# Altium schematic sheet LC BigOne - TLC5940 driver.SchDoc: DBL TLC5940 driver for High load
size A4; Revision: 0; SheetNumber: 1; SheetTotal: 2; Version: 1.0; Variant: Variant; Modification: Mod; Project: Light Control; PageSetup: Record=PageOptions|CenterHorizontal=True|CenterVertical=True|PrintScale=0.97|XCorrection=1.00|YCorrection=1.00|PrintKind=1|BorderSize=5000000|LeftOffset=0|BottomOffset=0|Orientation=2|PaperLength=2970|PaperWidth=2100|Scale=100|PaperSource=7|PrintQuality=-4|MediaType=1|DitherType=10|PaperKind=A4|PrintScaleMode=1
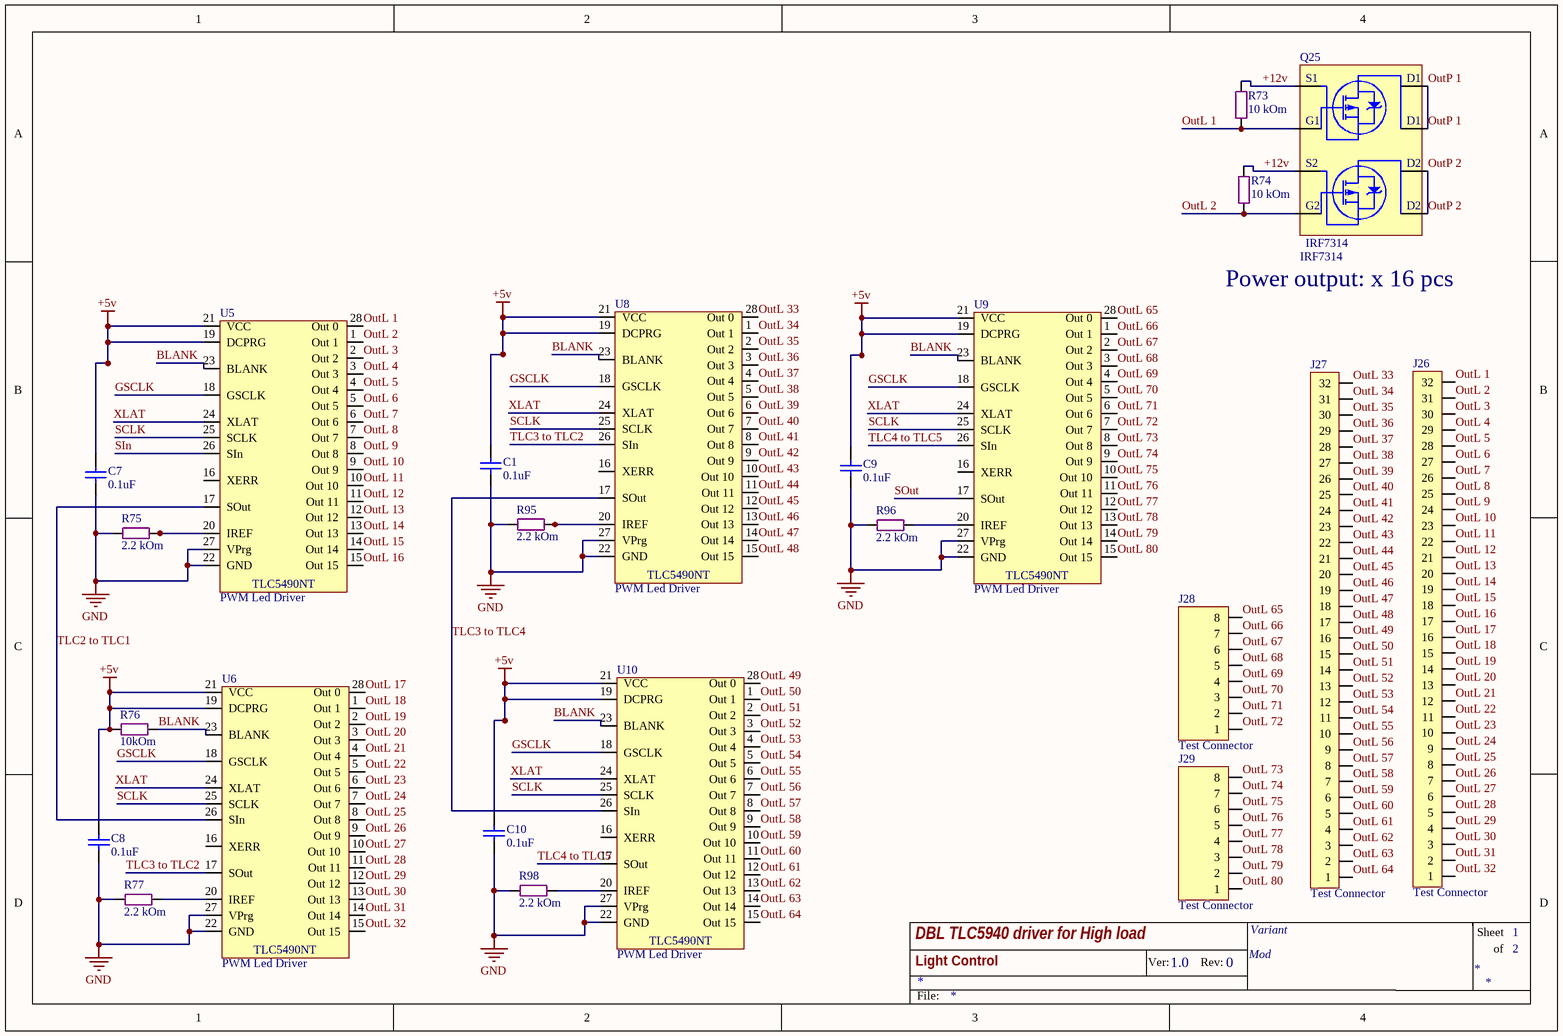
[diagram p0: LC BigOne - TLC5940 driver.SchDoc]

## Parts
C1  0.1uF  [SMD 0805 (2012)]
C7  0.1uF  [SMD 0805 (2012)]
C8  0.1uF  [SMD 0805 (2012)]
C9  0.1uF  [SMD 0805 (2012)]
C10  0.1uF  [SMD 0805 (2012)]
J26  Test Connector  [LINE 2.54 x 32]
J27  Test Connector  [LINE 2.54 x 32]
J28  Test Connector  [Line 2.54 x 8]
J29  Test Connector  [Line 2.54 x 8]
Q25  IRF7314  [SO8]
R73  10 kOm  [SMD 0805 (2012)]
R74  10 kOm  [SMD 0805 (2012)]
R75  2.2 kOm  [SMD 0805 (2012)]
R76  10kOm  [SMD 0805 (2012)]
R77  2.2 kOm  [SMD 0805 (2012)]
R95  2.2 kOm  [SMD 0805 (2012)]
R96  2.2 kOm  [SMD 0805 (2012)]
R98  2.2 kOm  [SMD 0805 (2012)]
U5  PWM Led Driver  [DIP-28 (OVAL)]
U6  PWM Led Driver  [DIP-28 (OVAL)]
U8  PWM Led Driver  [DIP-28 (OVAL)]
U9  PWM Led Driver  [DIP-28 (OVAL)]
U10  PWM Led Driver  [DIP-28 (OVAL)]

## Nets
+5v: C1.1 C7.1 C8.1 C9.1 C10.1 R76.1 U5.19(DCPRG) U5.21(VCC) U6.19(DCPRG) U6.21(VCC) U8.19(DCPRG) U8.21(VCC) U9.19(DCPRG) U9.21(VCC) U10.19(DCPRG) U10.21(VCC)
GND: C1.2 C7.2 C8.2 C9.2 C10.2 R75.2 R77.2 R95.2 R96.2 R98.2 U5.22(GND) U5.27(VPrg) U6.22(GND) U6.27(VPrg) U8.22(GND) U8.27(VPrg) U9.22(GND) U9.27(VPrg) U10.22(GND) U10.27(VPrg)
+12v: Q25.1(S) Q25.3(S) R73.2 R74.2
BLANK: R76.2 U5.23(BLANK) U6.23(BLANK) U8.23(BLANK) U9.23(BLANK) U10.23(BLANK)
GSCLK: U5.18(GSCLK) U6.18(GSCLK) U8.18(GSCLK) U9.18(GSCLK) U10.18(GSCLK)
OutL 1: J26.32 Q25.2(G) R73.1 U5.28(Out_0)
OutL 2: J26.31 Q25.4(G) R74.1 U5.1(Out_1)
OutL 3: J26.30 U5.2(Out_2)
OutL 4: J26.29 U5.3(Out_3)
OutL 5: J26.28 U5.4(Out_4)
OutL 6: J26.27 U5.5(Out_5)
OutL 7: J26.26 U5.6(Out_6)
OutL 8: J26.25 U5.7(Out_7)
OutL 9: J26.24 U5.8(Out_8)
OutL 10: J26.23 U5.9(Out_9)
OutL 11: J26.22 U5.10(Out_10)
OutL 12: J26.21 U5.11(Out_11)
OutL 13: J26.20 U5.12(Out_12)
OutL 14: J26.19 U5.13(Out_13)
OutL 15: J26.18 U5.14(Out_14)
OutL 16: J26.17 U5.15(Out_15)
OutL 17: J26.16 U6.28(Out_0)
OutL 18: J26.15 U6.1(Out_1)
OutL 19: J26.14 U6.2(Out_2)
OutL 20: J26.13 U6.3(Out_3)
OutL 21: J26.12 U6.4(Out_4)
OutL 22: J26.11 U6.5(Out_5)
OutL 23: J26.10 U6.6(Out_6)
OutL 24: J26.9 U6.7(Out_7)
OutL 25: J26.8 U6.8(Out_8)
OutL 26: J26.7 U6.9(Out_9)
OutL 27: J26.6 U6.10(Out_10)
OutL 28: J26.5 U6.11(Out_11)
OutL 29: J26.4 U6.12(Out_12)
OutL 30: J26.3 U6.13(Out_13)
OutL 31: J26.2 U6.14(Out_14)
OutL 32: J26.1 U6.15(Out_15)
OutL 33: J27.32 U8.28(Out_0)
OutL 34: J27.31 U8.1(Out_1)
OutL 35: J27.30 U8.2(Out_2)
OutL 36: J27.29 U8.3(Out_3)
OutL 37: J27.28 U8.4(Out_4)
OutL 38: J27.27 U8.5(Out_5)
OutL 39: J27.26 U8.6(Out_6)
OutL 40: J27.25 U8.7(Out_7)
OutL 41: J27.24 U8.8(Out_8)
OutL 42: J27.23 U8.9(Out_9)
OutL 43: J27.22 U8.10(Out_10)
OutL 44: J27.21 U8.11(Out_11)
OutL 45: J27.20 U8.12(Out_12)
OutL 46: J27.19 U8.13(Out_13)
OutL 47: J27.18 U8.14(Out_14)
OutL 48: J27.17 U8.15(Out_15)
OutL 49: J27.16 U10.28(Out_0)
OutL 50: J27.15 U10.1(Out_1)
OutL 51: J27.14 U10.2(Out_2)
OutL 52: J27.13 U10.3(Out_3)
OutL 53: J27.12 U10.4(Out_4)
OutL 54: J27.11 U10.5(Out_5)
OutL 55: J27.10 U10.6(Out_6)
OutL 56: J27.9 U10.7(Out_7)
OutL 57: J27.8 U10.8(Out_8)
OutL 58: J27.7 U10.9(Out_9)
OutL 59: J27.6 U10.10(Out_10)
OutL 60: J27.5 U10.11(Out_11)
OutL 61: J27.4 U10.12(Out_12)
OutL 62: J27.3 U10.13(Out_13)
OutL 63: J27.2 U10.14(Out_14)
OutL 64: J27.1 U10.15(Out_15)
OutL 65: J28.8 U9.28(Out_0)
OutL 66: J28.7 U9.1(Out_1)
OutL 67: J28.6 U9.2(Out_2)
OutL 68: J28.5 U9.3(Out_3)
OutL 69: J28.4 U9.4(Out_4)
OutL 70: J28.3 U9.5(Out_5)
OutL 71: J28.2 U9.6(Out_6)
OutL 72: J28.1 U9.7(Out_7)
OutL 73: J29.8 U9.8(Out_8)
OutL 74: J29.7 U9.9(Out_9)
OutL 75: J29.6 U9.10(Out_10)
OutL 76: J29.5 U9.11(Out_11)
OutL 77: J29.4 U9.12(Out_12)
OutL 78: J29.3 U9.13(Out_13)
OutL 79: J29.2 U9.14(Out_14)
OutL 80: J29.1 U9.15(Out_15)
OutP 1: Q25.7(D) Q25.8(D)
OutP 2: Q25.5(D) Q25.6(D)
SCLK: U5.25(SCLK) U6.25(SCLK) U8.25(SCLK) U9.25(SCLK) U10.25(SCLK)
SIn: U5.26(SIn)
SOut: U9.17(SOut)
TLC2 to TLC1: U5.17(SOut) U6.26(SIn)
TLC3 to TLC2: U6.17(SOut) U8.26(SIn)
TLC3 to TLC4: U8.17(SOut) U10.26(SIn)
TLC4 to TLC5: U9.26(SIn) U10.17(SOut)
XLAT: U5.24(XLAT) U6.24(XLAT) U8.24(XLAT) U9.24(XLAT) U10.24(XLAT)
NetR75_1: R75.1 U5.20(IREF)
NetR77_1: R77.1 U6.20(IREF)
NetR95_1: R95.1 U8.20(IREF)
NetR96_1: R96.1 U9.20(IREF)
NetR98_1: R98.1 U10.20(IREF)

Not connected (* = marked no-connect by the designer): U5 16(XERR); U6 16(XERR); U8 16(XERR); U9 16(XERR); U10 16(XERR)

## Notes on the sheet
- Power output: x 16 pcs
- Ver:
- Rev:
- Sheet
- of
- File:
- (in symbol IRF7314) S1; D1; G1; S2; D2; G2
- (in symbol TLC5940) TLC5490NT

## Library data of the parts
C1 C7-C10 = Cap SMD 0402-1812: Capacitor
J26 J27 = PLS-32: Vert, Sgl line, Male
J28 J29 = PLS-8: Vert, Sgl line, Male
Q25 = IRF7314: Dual P-Ch  20V - 0.058Ω - 5.3A; Monufacturer: IOR; RDS Сопротивление Сток-Исток: 0.058 Om; I d - Drain current (continuous) at TC = 100°C: 4.3 A; VGS Порог Открытия: -0.7 V; VGS Макс напр на гейте: +-12 V; C ISS Входная емкость: 780 pF; C OSS Выходная емкость: 470 pF; V DSS (v): 20V; I d - Drain current (continuous) at TC = 25°C: 5.3 A; Name: IRF7314; Datasheet: http://tec.org.ru/_bd/2/277_IRF7314-IR.pdf; URL: http://tec.org.ru/board/49-1-0-277
R73-R77 R95 R96 R98 = Res All Types
U5 U6 U8-U10 = TLC5940: 16-Channel LED Driver With DOT Correction and Grayscale PWM Control; DataSheet: http://www.ti.com/lit/ds/symlink/tlc5940.pdf